# EAGLE design lb1360_to_ba6208 (EAGLE 5.07)
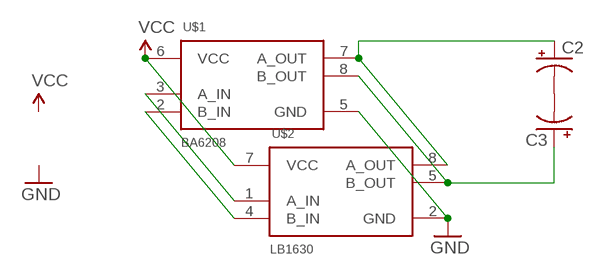
[diagram p0: schematic, sheet 1]

## Parts
C2  CPOL-USE2.5-7  [E2,5-7]
C3  CPOL-USE2.5-7  [E2,5-7]
U$1  BA6208  [SIP-9]
U$2  LB1630  [DIL08]

## Nets
GND: U$1.5(GND) U$2.2(GND)
N$1: C2.- C3.-
N$3: U$1.3(A_IN) U$2.1(A_IN)
N$4: U$1.2(B_IN) U$2.4(B_IN)
N$5: C3.+ U$1.8(B_OUT) U$2.5(B_OUT)
N$6: C2.+ U$1.7(A_OUT) U$2.8(A_OUT)
VCC: U$1.6(VCC) U$2.7(VCC)

## Library data of the parts
C2 C3 = rcl:CPOL-US: POLARIZED CAPACITOR, American symbol
U$1 = suapapa:BA6208
U$2 = suapapa:LB1630

## Board
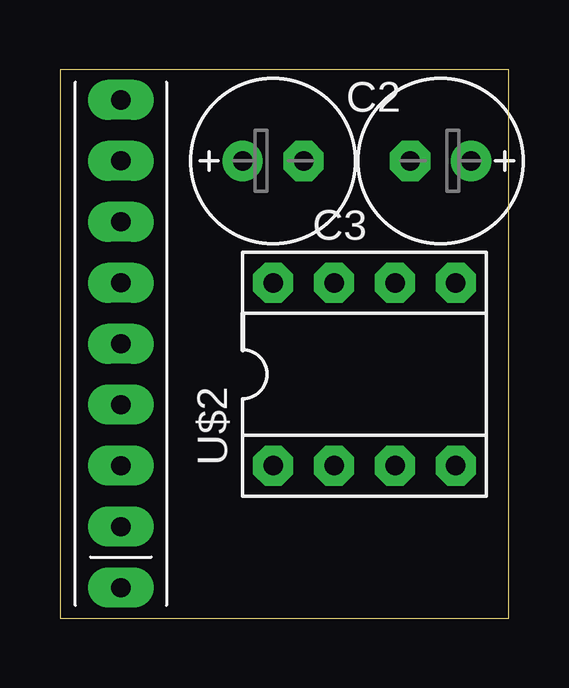
[diagram p1: board, top side]
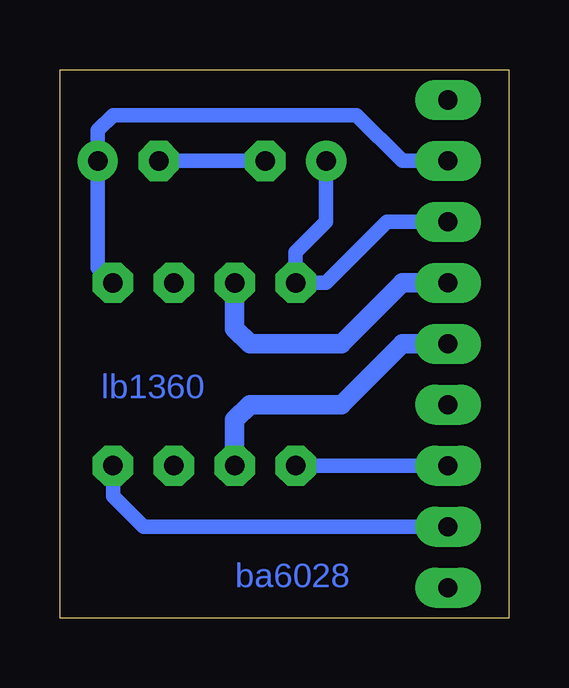
[diagram p2: board, bottom side, seen from below]

Size 18.72 x 22.85 mm. Coordinates in mm from the lower left corner, seen from the top.
Outline: 0,0 18.72,0 18.72,22.85 0,22.85 0,0
Copper layers (1*16): Top 0.035mm / dielectric 1.5mm / Bottom 0.035mm
Design rules "default *": minimum track width 10mil, minimum drill 24mil, track to track 8mil, track to pad 8mil, pad to pad 8mil, via to via 8mil, smd to smd 8mil, copper to edge 40mil, drill to drill 8mil, minimum pad ring 17mil, minimum via ring 8mil, stop-mask expansion 4mil, vias tented up to drill 0mil, thermal gap 10mil

### Footprints (pad centres in the part's own frame; a part is rotated, then mirrored left to right if it is on the bottom)
E2,5-7 = drill 0.813 pad 1.6 round: + -1.27,0 | drill 0.813 pad 1.6 octagon: - 1.27,0
SIP-9 = drill 0.8 long: 1 -10.16,0; 2 -7.62,0; 3 -5.08,0; 4 -2.54,0; 5 0,0; 6 2.54,0; 7 5.08,0; 8 7.62,0; 9 10.16,0
DIL08 = drill 0.813 pad 1.6 octagon: 1 -3.81,-3.81; 2 -1.27,-3.81; 3 1.27,-3.81; 4 3.81,-3.81; 5 3.81,3.81; 6 1.27,3.81; 7 -1.27,3.81; 8 -3.81,3.81

### Placement (x,y rotation side)
C2  8.89,19.05 0 top
C3  15.88,19.05 180 top
U$1  2.54,11.43 90 top
U$2  12.7,10.16 0 top

### Tracks (layer width: path | path; a pad name or v marks a point on that pad's centre or on a via)
GND
  Bottom 0.813: U$1.5 4.45,11.43 6.99,8.89 10.79,8.89 11.43,8.26 U$2.2
N$1
  Bottom 0.61: C2.- C3.-
N$3
  Bottom 0.61: U$1.3 U$2.1
N$4
  Bottom 0.61: U$1.2 15.24,3.81 16.51,5.08 U$2.4
N$5
  Bottom 0.61: U$2.5 17.14,14.61 C3.+ 17.14,20.32 16.51,20.95 6.35,20.95 4.45,19.05 U$1.8
N$6
  Bottom 0.61: U$1.7 5.08,16.51 7.62,13.97 U$2.8 8.89,15.24 7.62,16.51 C2.+
VCC
  Bottom 0.813: U$1.6 4.45,13.97 6.99,11.43 10.79,11.43 11.43,12.06 U$2.7

### Text on the board
Bottom: lb1360 | ba6028